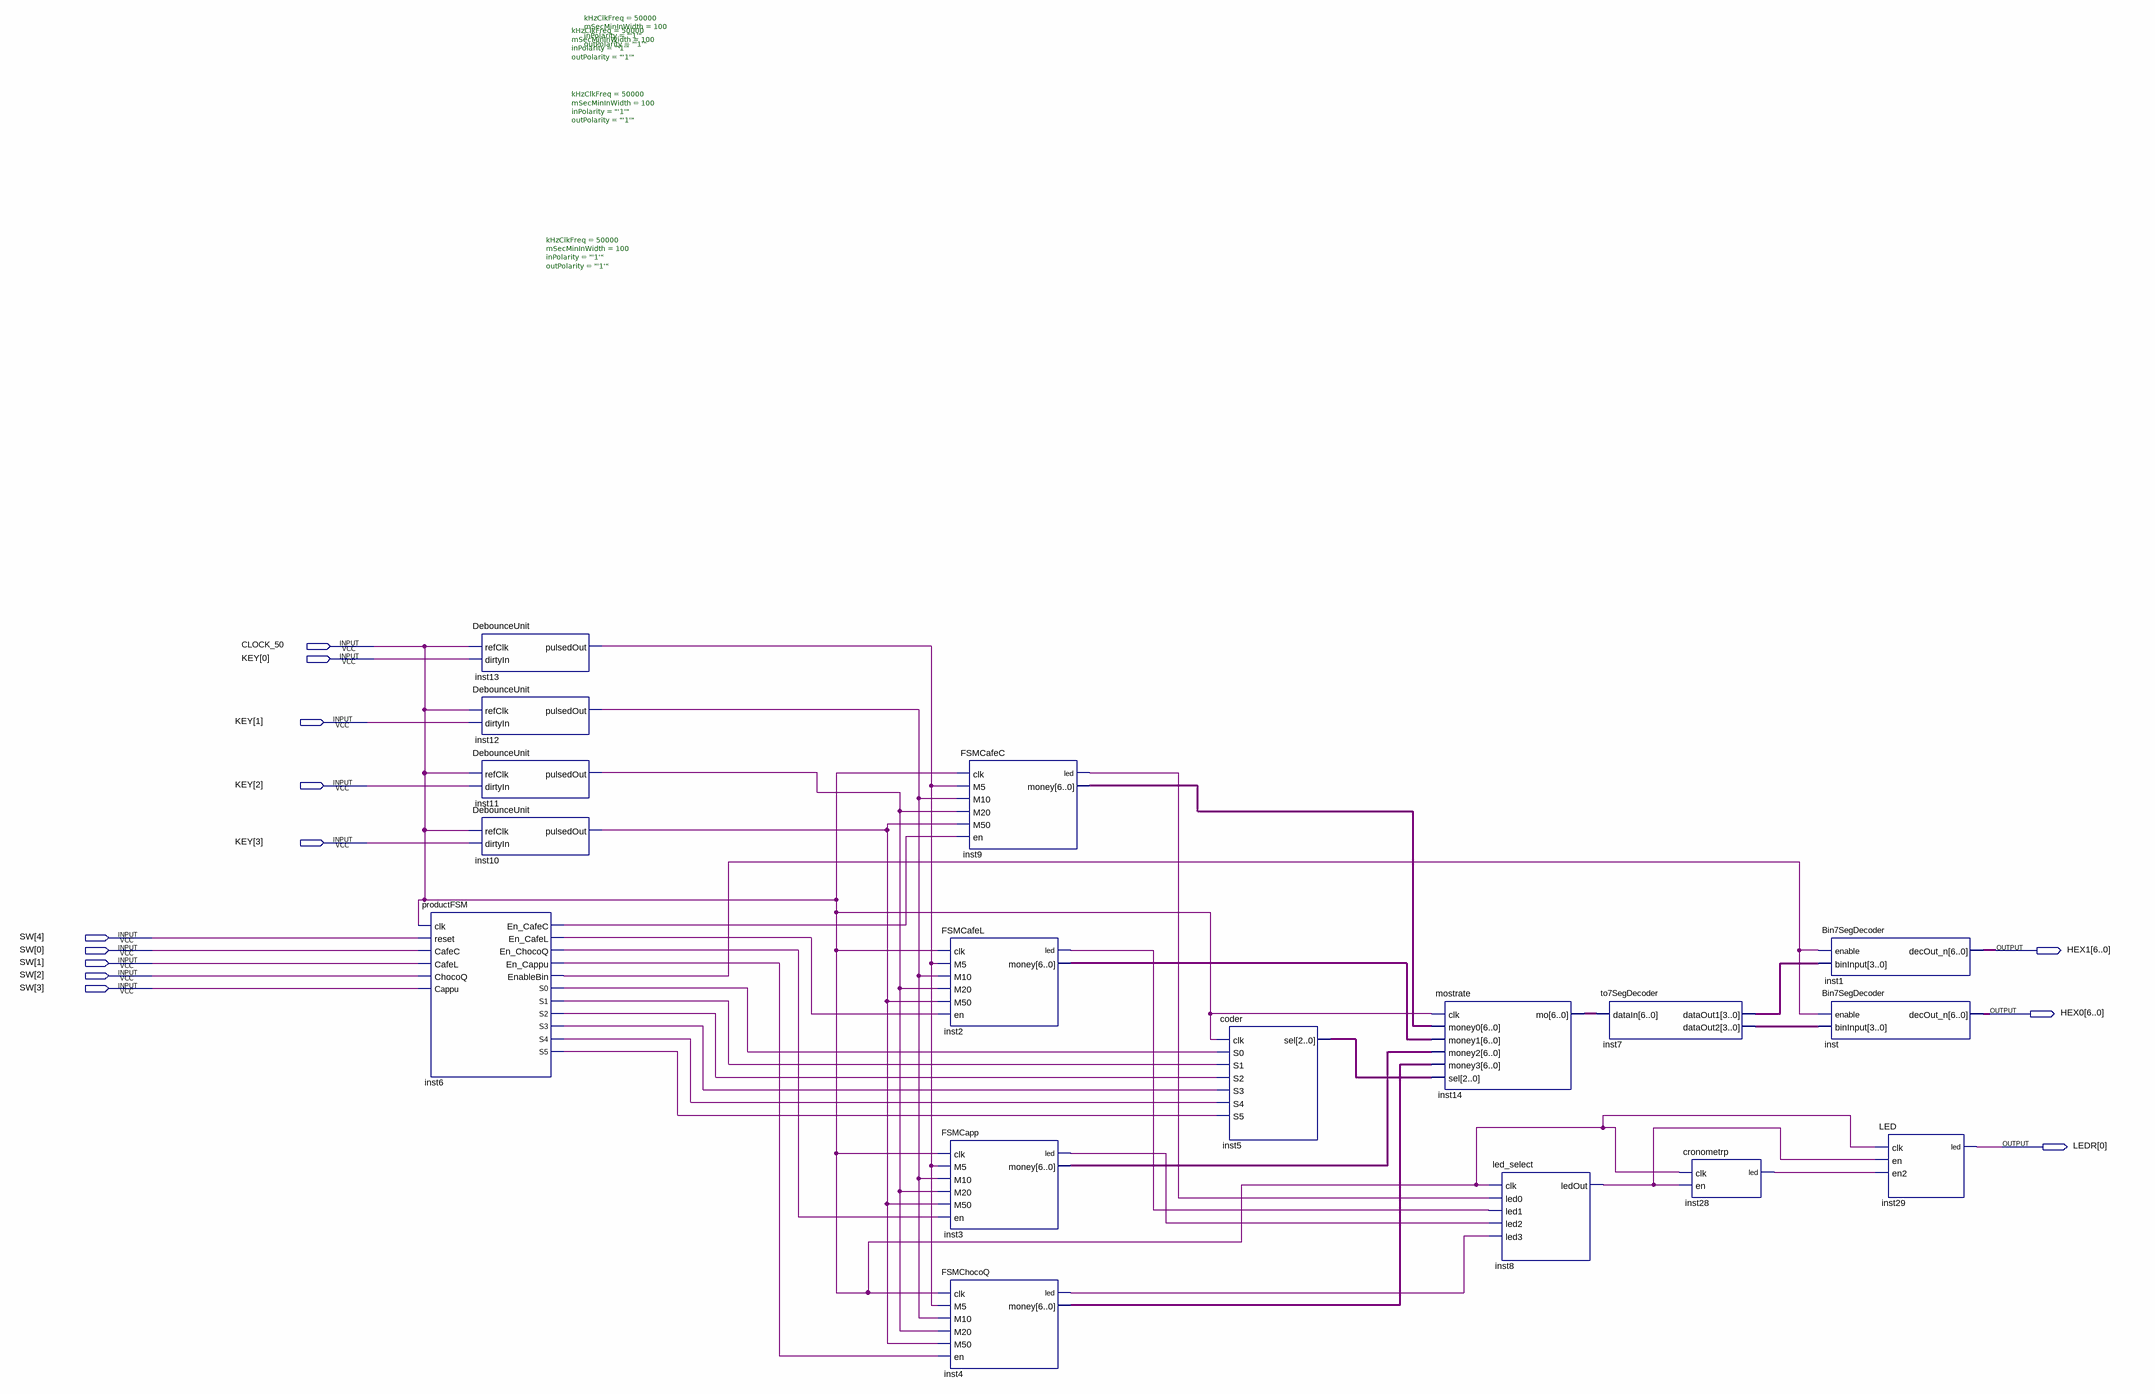
[diagram p0: schematic sheet]
// Quartus schematic test.bdf as structural Verilog: 17 symbols, 13 pins
module test (
  input  CLOCK_50,
  input  [3:0] KEY,
  input  [4:0] SW,
  output [6:0] HEX1,
  output [6:0] HEX0,
  output [0:0] LEDR
);

  wire inst2_led, inst3_led, inst4_led, inst6_en_cafec, inst6_en_cafel, inst6_en_cappu, inst6_en_chocoq,
       inst6_enablebin, inst6_s0, inst6_s1, inst6_s2, inst6_s3, inst6_s4, inst6_s5, inst8_ledout, inst9_led,
       inst10_pulsedout, inst11_pulsedout, inst12_pulsedout, inst13_pulsedout, inst28_led;
  wire [2:0] inst5_sel;
  wire [3:0] inst7_dataout1, inst7_dataout2;
  wire [6:0] inst2_money, inst3_money, inst4_money, inst9_money, inst14_mo;

  productFSM inst6 (
    .clk(CLOCK_50), .reset(SW[4]), .CafeC(SW[0]), .CafeL(SW[1]), .ChocoQ(SW[2]), .Cappu(SW[3]),
    .En_CafeC(inst6_en_cafec), .En_CafeL(inst6_en_cafel), .En_ChocoQ(inst6_en_chocoq),
    .En_Cappu(inst6_en_cappu), .EnableBin(inst6_enablebin), .S0(inst6_s0), .S1(inst6_s1), .S2(inst6_s2),
    .S3(inst6_s3), .S4(inst6_s4), .S5(inst6_s5));
  DebounceUnit #(.kHzClkFreq(50000), .mSecMinInWidth(100), .inPolarity("'1'"), .outPolarity("'1'")) inst13 (
    .refClk(CLOCK_50), .dirtyIn(KEY[0]), .pulsedOut(inst13_pulsedout));
  DebounceUnit #(.kHzClkFreq(50000), .mSecMinInWidth(100), .inPolarity("'1'"), .outPolarity("'1'")) inst12 (
    .refClk(CLOCK_50), .dirtyIn(KEY[1]), .pulsedOut(inst12_pulsedout));
  DebounceUnit #(.kHzClkFreq(50000), .mSecMinInWidth(100), .inPolarity("'1'"), .outPolarity("'1'")) inst11 (
    .refClk(CLOCK_50), .dirtyIn(KEY[2]), .pulsedOut(inst11_pulsedout));
  DebounceUnit #(.kHzClkFreq(50000), .mSecMinInWidth(100), .inPolarity("'1'"), .outPolarity("'1'")) inst10 (
    .refClk(CLOCK_50), .dirtyIn(KEY[3]), .pulsedOut(inst10_pulsedout));
  FSMCafeL inst2 (
    .clk(CLOCK_50), .M5(inst13_pulsedout), .M10(inst12_pulsedout), .M20(inst11_pulsedout),
    .M50(inst10_pulsedout), .en(inst6_en_cafel), .led(inst2_led), .money(inst2_money));
  FSMCapp inst3 (
    .clk(CLOCK_50), .M5(inst13_pulsedout), .M10(inst12_pulsedout), .M20(inst11_pulsedout),
    .M50(inst10_pulsedout), .en(inst6_en_chocoq), .led(inst3_led), .money(inst3_money));
  FSMChocoQ inst4 (
    .clk(CLOCK_50), .M5(inst13_pulsedout), .M10(inst12_pulsedout), .M20(inst11_pulsedout),
    .M50(inst10_pulsedout), .en(inst6_en_cappu), .led(inst4_led), .money(inst4_money));
  FSMCafeC inst9 (
    .clk(CLOCK_50), .M5(inst13_pulsedout), .M10(inst12_pulsedout), .M20(inst11_pulsedout),
    .M50(inst10_pulsedout), .en(inst6_en_cafec), .led(inst9_led), .money(inst9_money));
  coder inst5 (
    .clk(CLOCK_50), .S0(inst6_s0), .S1(inst6_s1), .S2(inst6_s2), .S3(inst6_s3), .S4(inst6_s4), .S5(inst6_s5),
    .sel(inst5_sel));
  mostrate inst14 (
    .clk(CLOCK_50), .money0(inst9_money), .money1(inst2_money), .money2(inst3_money), .money3(inst4_money),
    .sel(inst5_sel), .mo(inst14_mo));
  led_select inst8 (
    .clk(CLOCK_50), .led0(inst9_led), .led1(inst2_led), .led2(inst3_led), .led3(inst4_led),
    .ledOut(inst8_ledout));
  to7SegDecoder inst7 (.dataIn(inst14_mo), .dataOut1(inst7_dataout1), .dataOut2(inst7_dataout2));
  cronometrp inst28 (.clk(CLOCK_50), .en(inst8_ledout), .led(inst28_led));
  Bin7SegDecoder inst1 (.enable(inst6_enablebin), .binInput(inst7_dataout1), .decOut_n(HEX1));
  Bin7SegDecoder inst (.enable(inst6_enablebin), .binInput(inst7_dataout2), .decOut_n(HEX0));
  LED inst29 (.clk(CLOCK_50), .en(inst8_ledout), .en2(inst28_led), .led(LEDR[0]));
endmodule
